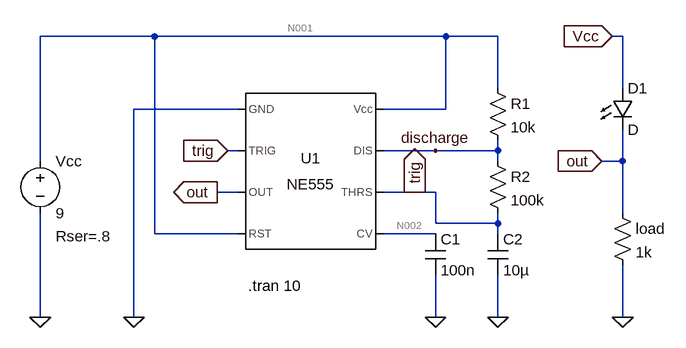
[diagram p0: schematic 555AstableFlipFlop.asc]
555AstableFlipFlop.asc, the LTspice schematic file:
Version 4
SHEET 1 880 680
WIRE -448 48 -624 48
WIRE 0 48 -448 48
WIRE 80 48 0 48
WIRE 272 48 256 48
WIRE 80 128 80 48
WIRE 272 128 272 48
WIRE -320 160 -480 160
WIRE 0 160 0 48
WIRE 0 160 -96 160
WIRE -320 224 -336 224
WIRE -16 224 -96 224
WIRE 80 224 80 208
WIRE 80 224 -16 224
WIRE -624 240 -624 48
WIRE 80 240 80 224
WIRE 272 240 272 192
WIRE 272 240 240 240
WIRE -320 288 -352 288
WIRE -48 288 -96 288
WIRE -16 288 -48 288
WIRE 272 320 272 240
WIRE -16 336 -16 288
WIRE 80 336 80 320
WIRE 80 336 -16 336
WIRE -448 352 -448 48
WIRE -320 352 -448 352
WIRE -16 352 -96 352
WIRE 80 352 80 336
WIRE -624 480 -624 320
WIRE -480 480 -480 160
WIRE -16 480 -16 416
WIRE 80 480 80 416
WIRE 272 480 272 400
FLAG -480 480 0
FLAG -16 480 0
FLAG 80 480 0
FLAG -624 480 0
FLAG 240 240 out
IOPIN 240 240 In
FLAG -352 288 out
IOPIN -352 288 Out
FLAG 256 48 Vcc
IOPIN 256 48 In
FLAG 272 480 0
FLAG -336 224 trig
IOPIN -336 224 In
FLAG -48 288 trig
IOPIN -48 288 Out
FLAG -16 224 discharge
SYMBOL Misc\\NE555 -208 256 R0
SYMATTR InstName U1
SYMBOL cap -32 352 R0
SYMATTR InstName C1
SYMATTR Value 100n
SYMBOL res 64 112 R0
SYMATTR InstName R1
SYMATTR Value 10k
SYMATTR SpiceLine tol=1 pwr=0.1
SYMBOL res 64 224 R0
SYMATTR InstName R2
SYMATTR Value 100k
SYMATTR SpiceLine tol=1 pwr=0.1
SYMBOL cap 64 352 R0
SYMATTR InstName C2
SYMATTR Value 10µ
SYMATTR SpiceLine V=25 Irms=0 Rser=0.007 MTBF=0 Lser=0 ppPkg=1
SYMBOL voltage -624 224 R0
WINDOW 123 0 0 Left 0
WINDOW 39 24 132 Left 0
SYMATTR SpiceLine Rser=.8
SYMATTR InstName Vcc
SYMATTR Value 9
SYMBOL res 256 304 R0
SYMATTR InstName load
SYMATTR Value 1k
SYMBOL LED 256 128 R0
SYMATTR InstName D1
TEXT -304 432 Left 0 !.tran 10

The netlist it stands for:
* 555AstableFlipFlop.asc
XU1 0 trig out N001 N002 trig discharge N001 NE555  ; pins GND TRIG OUT RST CV THRS DIS Vcc
C1 N002 0 100n
R1 N001 discharge 10k tol=1 pwr=0.1
R2 discharge trig 100k tol=1 pwr=0.1
C2 trig 0 10µ V=25 Irms=0 Rser=0.007 MTBF=0 Lser=0 ppPkg=1
Vcc N001 0 9 Rser=.8
R§load out 0 1k
D1 Vcc out D
.model D D
.lib standard.dio
.tran 10
.lib NE555.sub
.backanno
.end

* Results of the author's LTspice run, read from the files saved beside the schematic
* Operating Point, zero values left out:
*   V(trig) = 8.988 V
*   V(n002) = 5.994 V
*   V(n001) = 8.991 V
*   V(discharge) = 8.99 V
*   V(out) = 8.937 V
*   V(vcc) = 8.937 V
*   I(Load) = 8.937 mA
*   I(R2) = 17.98 nA
*   I(R1) = 29.97 nA
*   I(Vcc) = -11.84 mA
*   Ix(u1:1) = -2.905 mA
*   Ix(u1:2) = 8.988 nA
*   Ix(u1:3) = -8.937 mA
*   Ix(u1:4) = 49.27 µA
*   Ix(u1:6) = 8.988 nA
*   Ix(u1:7) = 12 nA
*   Ix(u1:8) = 11.79 mA
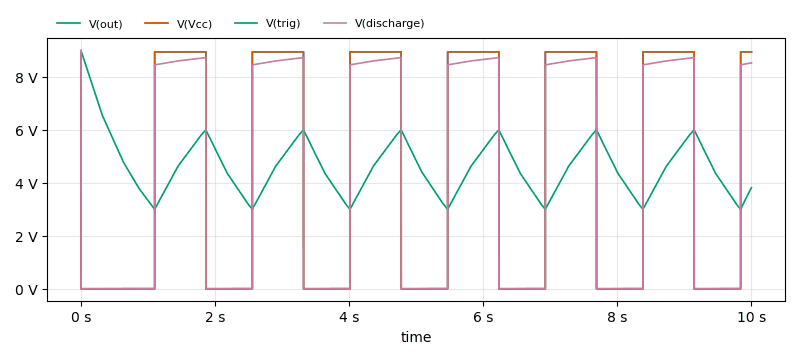
[diagram p1: Transient Analysis of 555AstableFlipFlop.asc, plotted from the saved traces]
* Transient Analysis, 1 run:
*   V(out): min 53.66 µV, max 8.938 V, average 4.235 V, rms 6.152 V, last 8.937 V
*   V(Vcc): min 53.66 µV, max 8.938 V, average 4.235 V, rms 6.152 V, last 8.937 V
*   V(trig): min 2.998 V, max 8.988 V, average 4.594 V, rms 4.749 V, last 3.817 V
*   V(discharge): min 5.574 mV, max 8.992 V, average 4.074 V, rms 5.914 V, last 8.52 V